# EAGLE design node (EAGLE 7.7.0)
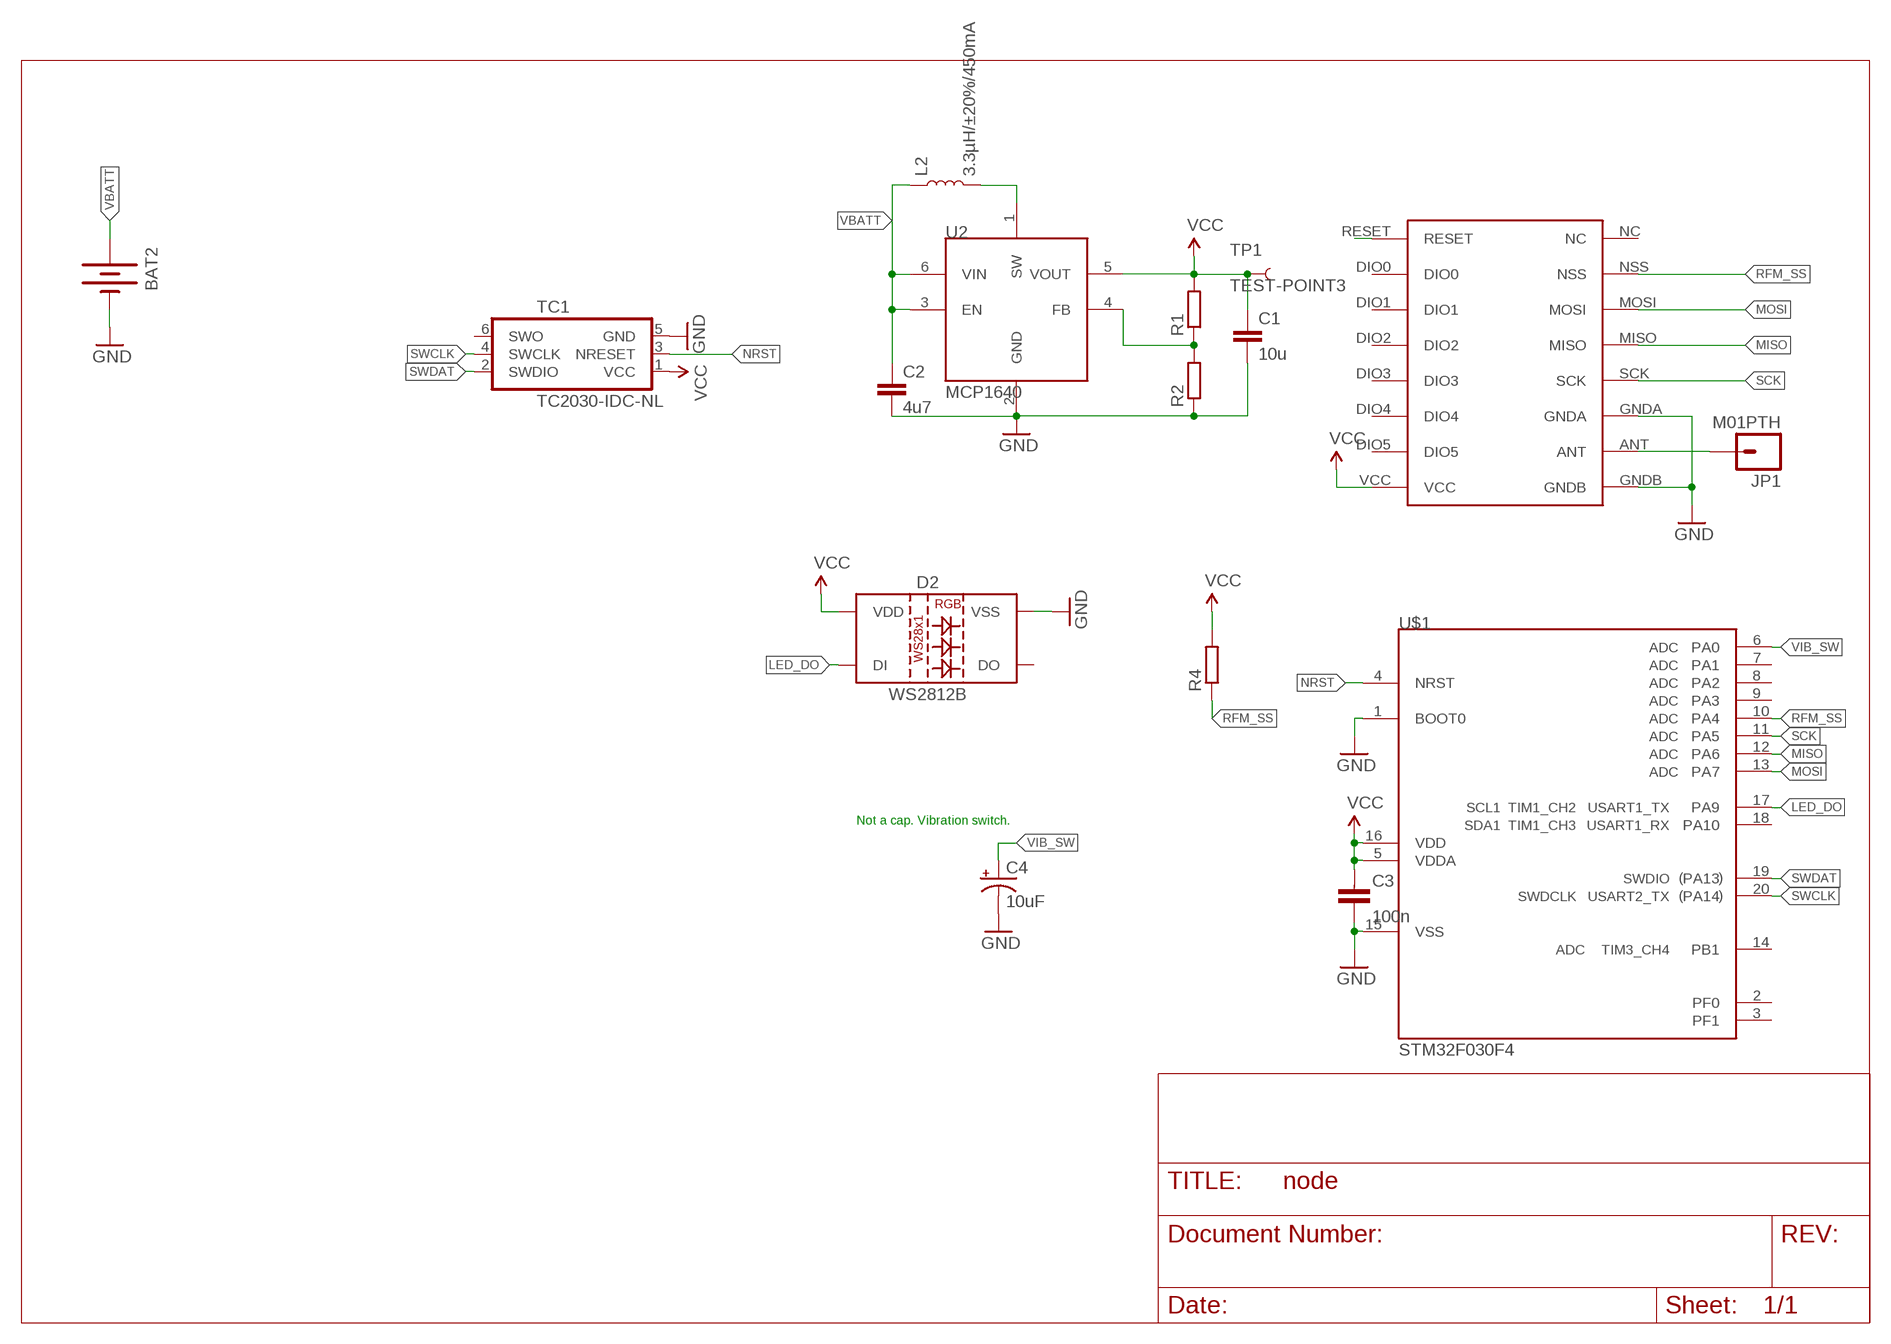
[diagram p0: schematic, sheet 1]

## Parts
BAT2  BATTERYAA  [BATTERY-AA]
C1  10u  C-EUC0603  [C0603]
C2  4u7  C-EUC0603  [C0603]
C3  100n  CAPACITOR0603-N  [C0603-N]
C4  10uF  10UF-POLAR-RADIAL-2.5MM-25V-20%  [CPOL-RADIAL-2.5MM-5MM]
D2  WS2812B  [WS2812B]
JP1  M01PTH  [1X01]
L2  3.3µH/±20%/450mA  INDUCTOR-0805-3.3UH  [0805]
R1  R-EU_R0603  [R0603]
R2  R-EU_R0603  [R0603]
R4  R-EU_R0603  [R0603]
TC1  TC2030-IDC-NL  [TC2030-IDC-NL]
TP1  TEST-POINT3  [PAD.03X.03]
U2  MCP1640  [SOT23-6]
U$1  STM32F030F4  [TSSOP20]
U$4  RFM69HW  [RFM]

## Nets
GND: BAT2.GND@1(-) C1.2 C2.2 C3.2 C4.2(-) D2.3(VSS) R2.1 TC1.5(GND) U2.2(GND) U$1.1(BOOT0) U$1.15(VSS) U$4.GNDA U$4.GNDB
LED_DO: D2.4(DI) U$1.17(PA9)
MISO: U$1.12(PA6) U$4.MISO
MOSI: U$1.13(PA7) U$4.MOSI
N$1: L2.2 U2.1(SW)
N$2: R1.1 R2.2 U2.4(FB)
N$3: JP1.1 U$4.ANT
N$7: U$4.RESET
NRST: TC1.3(NRESET) U$1.4(NRST)
RFM_SS: R4.1 U$1.10(PA4) U$4.NSS
SCK: U$1.11(PA5) U$4.SCK
SWCLK: TC1.4(SWCLK) U$1.20(PA14)
SWDAT: TC1.2(SWDIO) U$1.19(PA13)
VBATT: BAT2.PWR@1(+) C2.1 L2.1 U2.3(EN) U2.6(VIN)
VCC: C1.1 C3.1 D2.1(VDD) R1.2 R4.2 TC1.1(VCC) TP1.P$1 U2.5(VOUT) U$1.5(VDDA) U$1.16(VDD) U$4.VCC
VIB_SW: C4.1(+) U$1.6(PA0)
Unconnected: D2.2(DO) TC1.6(SWO) U$1.2(PF0) U$1.3(PF1) U$1.7(PA1) U$1.8(PA2) U$1.9(PA3) U$1.14(PB1) U$1.18(PA10) U$4.DIO0 U$4.DIO1 U$4.DIO2 U$4.DIO3 U$4.DIO4 U$4.DIO5 U$4.NC

## Notes on the sheet
- Not a cap. Vibration switch.

## Library data of the parts
BAT2 = SparkFun:BATTERY: Battery Holders Various common sizes : AA, AAA, 20mm coin cell and 12mm coin cell.
C1 C2 = rcl:C-EU: CAPACITOR, European symbol
C3 = passives-7351:CAPACITOR
C4 = SparkFun-Capacitors:10UF-POLAR: 10.0µF polarized capacitors A capacitor is a passive two-terminal electrical component used to store electrical energy temporarily in an electric field.; PROD_ID: CAP-08440
D2 = SparkFun-LED:WS2812B: WS2812B SMD addressable RGB LED 5x5mm SMD LED with built-in controller IC. Color: Red/Green/Blue mC Rating: RGB: 390, 660, 180 mcd Forward Voltage: RGB: 2.0, 3.0, 3.0 V Packages:WS2812B SparkFun Products: Blynk Board - ESP8266 <https://www.sparkfun.com/products/13794>; PROD_ID: DIO-12503
JP1 = SparkFun-Connectors:M01: Header 1 Standard 1-pin 0.1" header. Use with straight break away headers (SKU : PRT-00116), right angle break away headers (PRT-00553), swiss pins (PRT-00743), machine pins (PRT-00117), and female headers (PRT-00115).
L2 = SparkFun-Coils:INDUCTOR: Inductors Resist changes in electrical current. Basically a coil of wire. SparkFun Products: SparkFun Load Cell Amplifier - HX711 <https://www.sparkfun.com/products/13879> IOIO-OTG - V2.2 <https://www.sparkfun.com/products/13613>; PROD_ID: NDUC-13076
R1 R2 R4 = rcl:R-EU_: RESISTOR, European symbol
TC1 = TagConnect:TC2030-IDC: Tag-Connect In Circuit Programming & Debug Cable 6 Pin http://www.tag-connect.com
TP1 = SparkFun-Passives:TEST-POINT: Bare copper test points for troubleshooting or ICT
U2 = ukhas:MCP1640
U$1 = dtb:STM32F030F4
U$4 = hoperf:RFM69HW

## Board
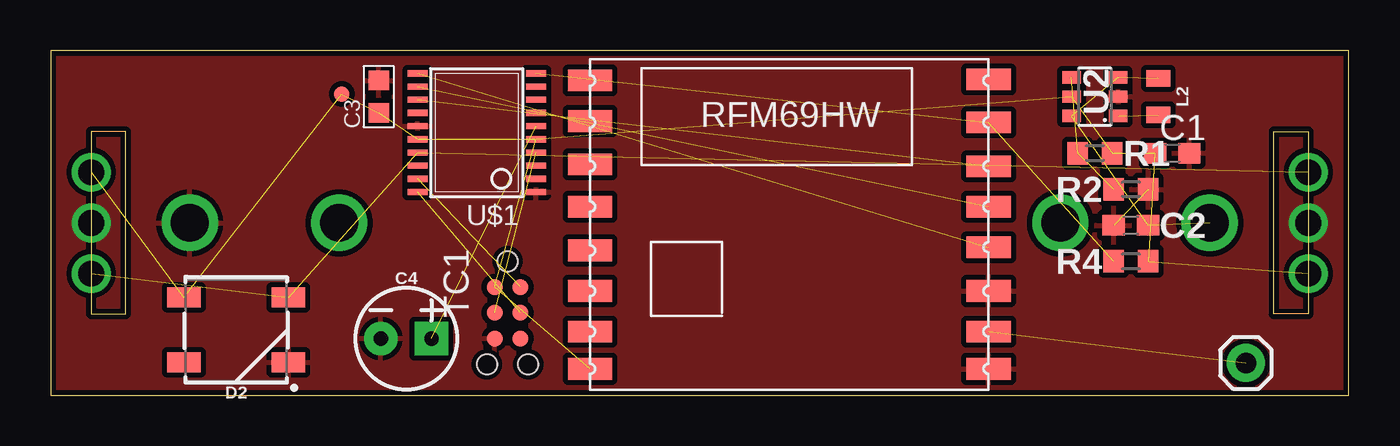
[diagram p1: board, top side]
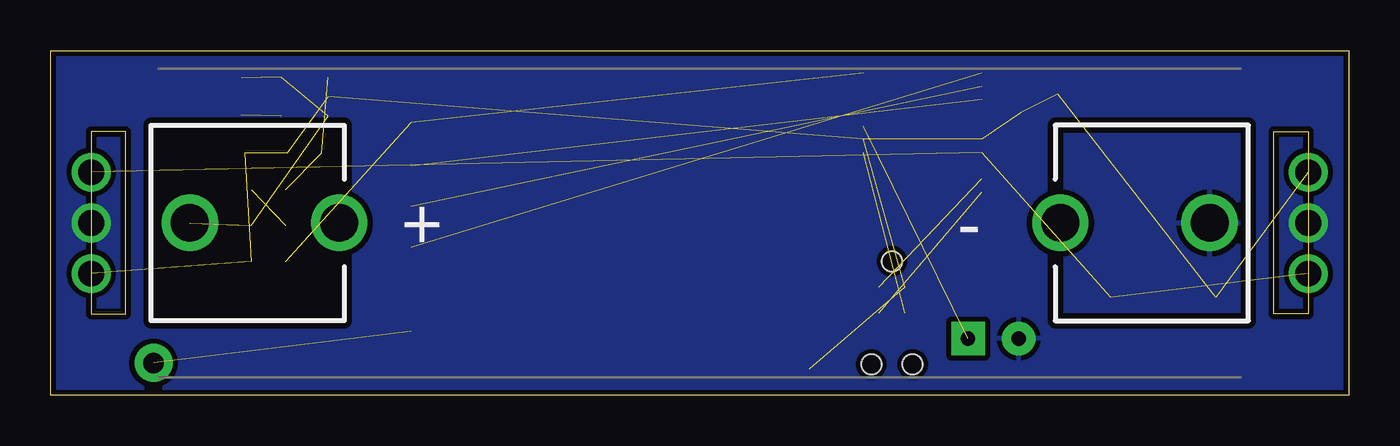
[diagram p2: board, bottom side, seen from below]

Size 64 x 17 mm. Coordinates in mm from the lower left corner, seen from the top.
Outline: 64,0 64,17 0,17 0,0 64,0
Outline: 2,13 2,4 3.7,4 3.7,13 2,13
Outline: 60.3,4 60.3,13 62,13 62,4 60.3,4
Copper layers (1*16): Top 0.035mm / dielectric 1.5mm / Bottom 0.035mm
Design rules "dirt_cheap_dirty_boards.v1": minimum track width 5mil, minimum drill 12mil, track to track 5mil, track to pad 5mil, pad to pad 5mil, via to via 5mil, smd to smd 0mil, copper to edge 10mil, drill to drill 10mil, minimum pad ring 10mil, minimum via ring 6mil, stop-mask expansion 2mil, vias tented up to drill 25mil, thermal gap 10mil

### Footprints (pad centres in the part's own frame; a part is rotated, then mirrored left to right if it is on the bottom)
BATTERY-AA = drill 1.854: GND@1 25.146,0; GND@2 17.78,0; PWR@1 -25.146,0; PWR@2 -17.78,0
C0603 = smd 1.1 x 1: 1 -0.85,0; 2 0.85,0
C0603-N = smd 0.95 x 1: 1 -0.8,0; 2 0.8,0
CPOL-RADIAL-2.5MM-5MM = drill 0.7 pad 1.651 square: 1 1.25,0 | drill 0.7 pad 1.651: 2 -1.25,0
WS2812B = smd 1.651 x 1: 1 2.577,-1.6; 2 2.577,1.6; 3 -2.577,1.6; 4 -2.577,-1.6
1X01 = drill 1.016 pad 1.88: 1 0,0
0805 = smd 0.8 x 1.2: 1 -0.9,0; 2 0.9,0
R0603 = smd 1 x 1.1: 1 -0.85,0; 2 0.85,0
TC2030-IDC-NL = smd 0.787 x 0.787: 1 -1.27,-0.635; 2 -1.27,0.635; 3 0,-0.635; 4 0,0.635; 5 1.27,-0.635; 6 1.27,0.635 | hole 0.991: -2.54,0; 2.54,1.016; 2.54,-1.016
PAD.03X.03 = smd 0.762 x 0.762: P$1 0,0
SOT23-6 = smd 0.6 x 0.9: 1 -0.95,-1.15; 2 0,-1.15; 3 0.95,-1.15; 4 0.95,1.15; 5 0,1.15; 6 -0.95,1.15
TSSOP20 = smd 0.305 x 0.991: 1 -2.925,-2.918; 2 -2.275,-2.918; 3 -1.625,-2.918; 4 -0.975,-2.918; 5 -0.325,-2.918; 6 0.325,-2.918; 7 0.975,-2.918; 8 1.625,-2.918; 9 2.275,-2.918; 10 2.925,-2.918; 11 2.925,2.918; 12 2.275,2.918; 13 1.625,2.918; 14 0.975,2.918; 15 0.325,2.918; 16 -0.325,2.918; 17 -0.975,2.918; 18 -1.625,2.918; 19 -2.275,2.918; 20 -2.925,2.918
RFM = smd 2.184 x 1.067: ANT 19.651,2.889; DIO0 0,13.27; DIO1 0,11.143; DIO2 0,9.047; DIO3 0,6.889; DIO4 0,4.889; DIO5 0,2.889; GNDA 19.651,4.889; GNDB 19.651,1.048; MISO 19.651,9.047; MOSI 19.651,11.047; NC 19.651,15.334; NSS 19.651,13.206; RESET 0,15.27; SCK 19.651,7.048; VCC 0,1.048

### Placement (x,y rotation side)
BAT2  32,8.5 0 bottom
C1  55.29,11.94 0 top
C2  53.26,8.38 180 top
C3  16.18,14.73 90 top
C4  17.53,2.79 0 top
D2  9.14,3.22 180 top
JP1  58.93,1.59 0 top
L2  54.61,14.73 270 top
R1  51.48,11.94 0 top
R2  53.26,10.16 180 top
R4  53.26,6.6 0 top
TC1  22.53,4.06 270 top
TP1  14.35,14.86 0 top
U2  51.48,14.73 90 top
U$1  21,12.95 90 top
U$4  26.59,0.25 0 top

### Tracks (layer width: path | path; a pad name or v marks a point on that pad's centre or on a via)
GND  (via drill 1.27)  (1 unrouted)
  other vias: 2,8.5 62,8.5
  pour Top (isolate 0.254): 0,17.11 63.89,17.11 63.89,0 0,0
  pour Bottom (isolate 0.254): 0,0 0,17.11 63.89,17.11 63.89,0
LED_DO  (via drill 1.27)  (3 unrouted)
  other vias: 2,6 62,11
MISO  (1 unrouted)
MOSI  (1 unrouted)
N$1  (1 unrouted)
N$2  (2 unrouted)
N$3  (1 unrouted)
NRST  (1 unrouted)
RFM_SS  (2 unrouted)
SCK  (1 unrouted)
SWCLK  (1 unrouted)
SWDAT  (1 unrouted)
VBATT  (4 unrouted)
VCC  (via drill 1.27)  (12 unrouted)
  other vias: 2,11 62,6
VIB_SW  (1 unrouted)